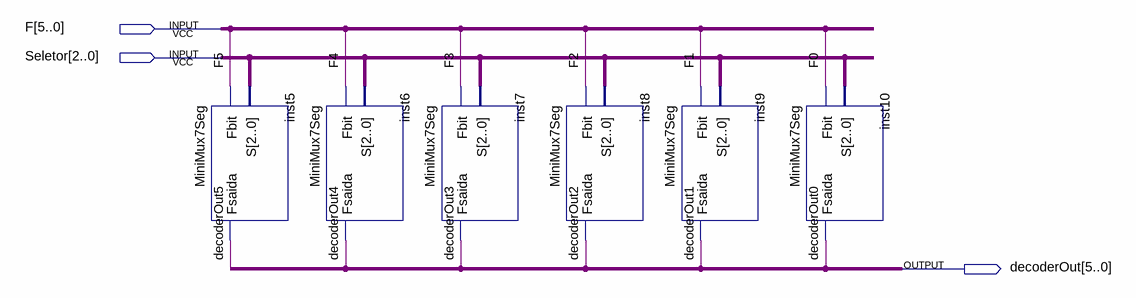
[diagram p0: schematic sheet]
// Quartus schematic MUX7segmentos.bdf as structural Verilog: 6 symbols, 3 pins
module MUX7segmentos (
  input  [5:0] F,
  input  [2:0] Seletor,
  output [5:0] decoderOut
);

  MiniMux7Seg inst5 (.Fbit(F[5]), .S(Seletor), .Fsaida(decoderOut[5]));
  MiniMux7Seg inst6 (.Fbit(F[4]), .S(Seletor), .Fsaida(decoderOut[4]));
  MiniMux7Seg inst7 (.Fbit(F[3]), .S(Seletor), .Fsaida(decoderOut[3]));
  MiniMux7Seg inst8 (.Fbit(F[2]), .S(Seletor), .Fsaida(decoderOut[2]));
  MiniMux7Seg inst9 (.Fbit(F[1]), .S(Seletor), .Fsaida(decoderOut[1]));
  MiniMux7Seg inst10 (.Fbit(F[0]), .S(Seletor), .Fsaida(decoderOut[0]));
endmodule
